# EasyEDA schematic 1-Schematic_servo-power.json
TITLE: Sheet_1; REV: 1.0; Date: 2020-10-06; Sheet: 1/1; Drawn By: udinic; Company: Your Company
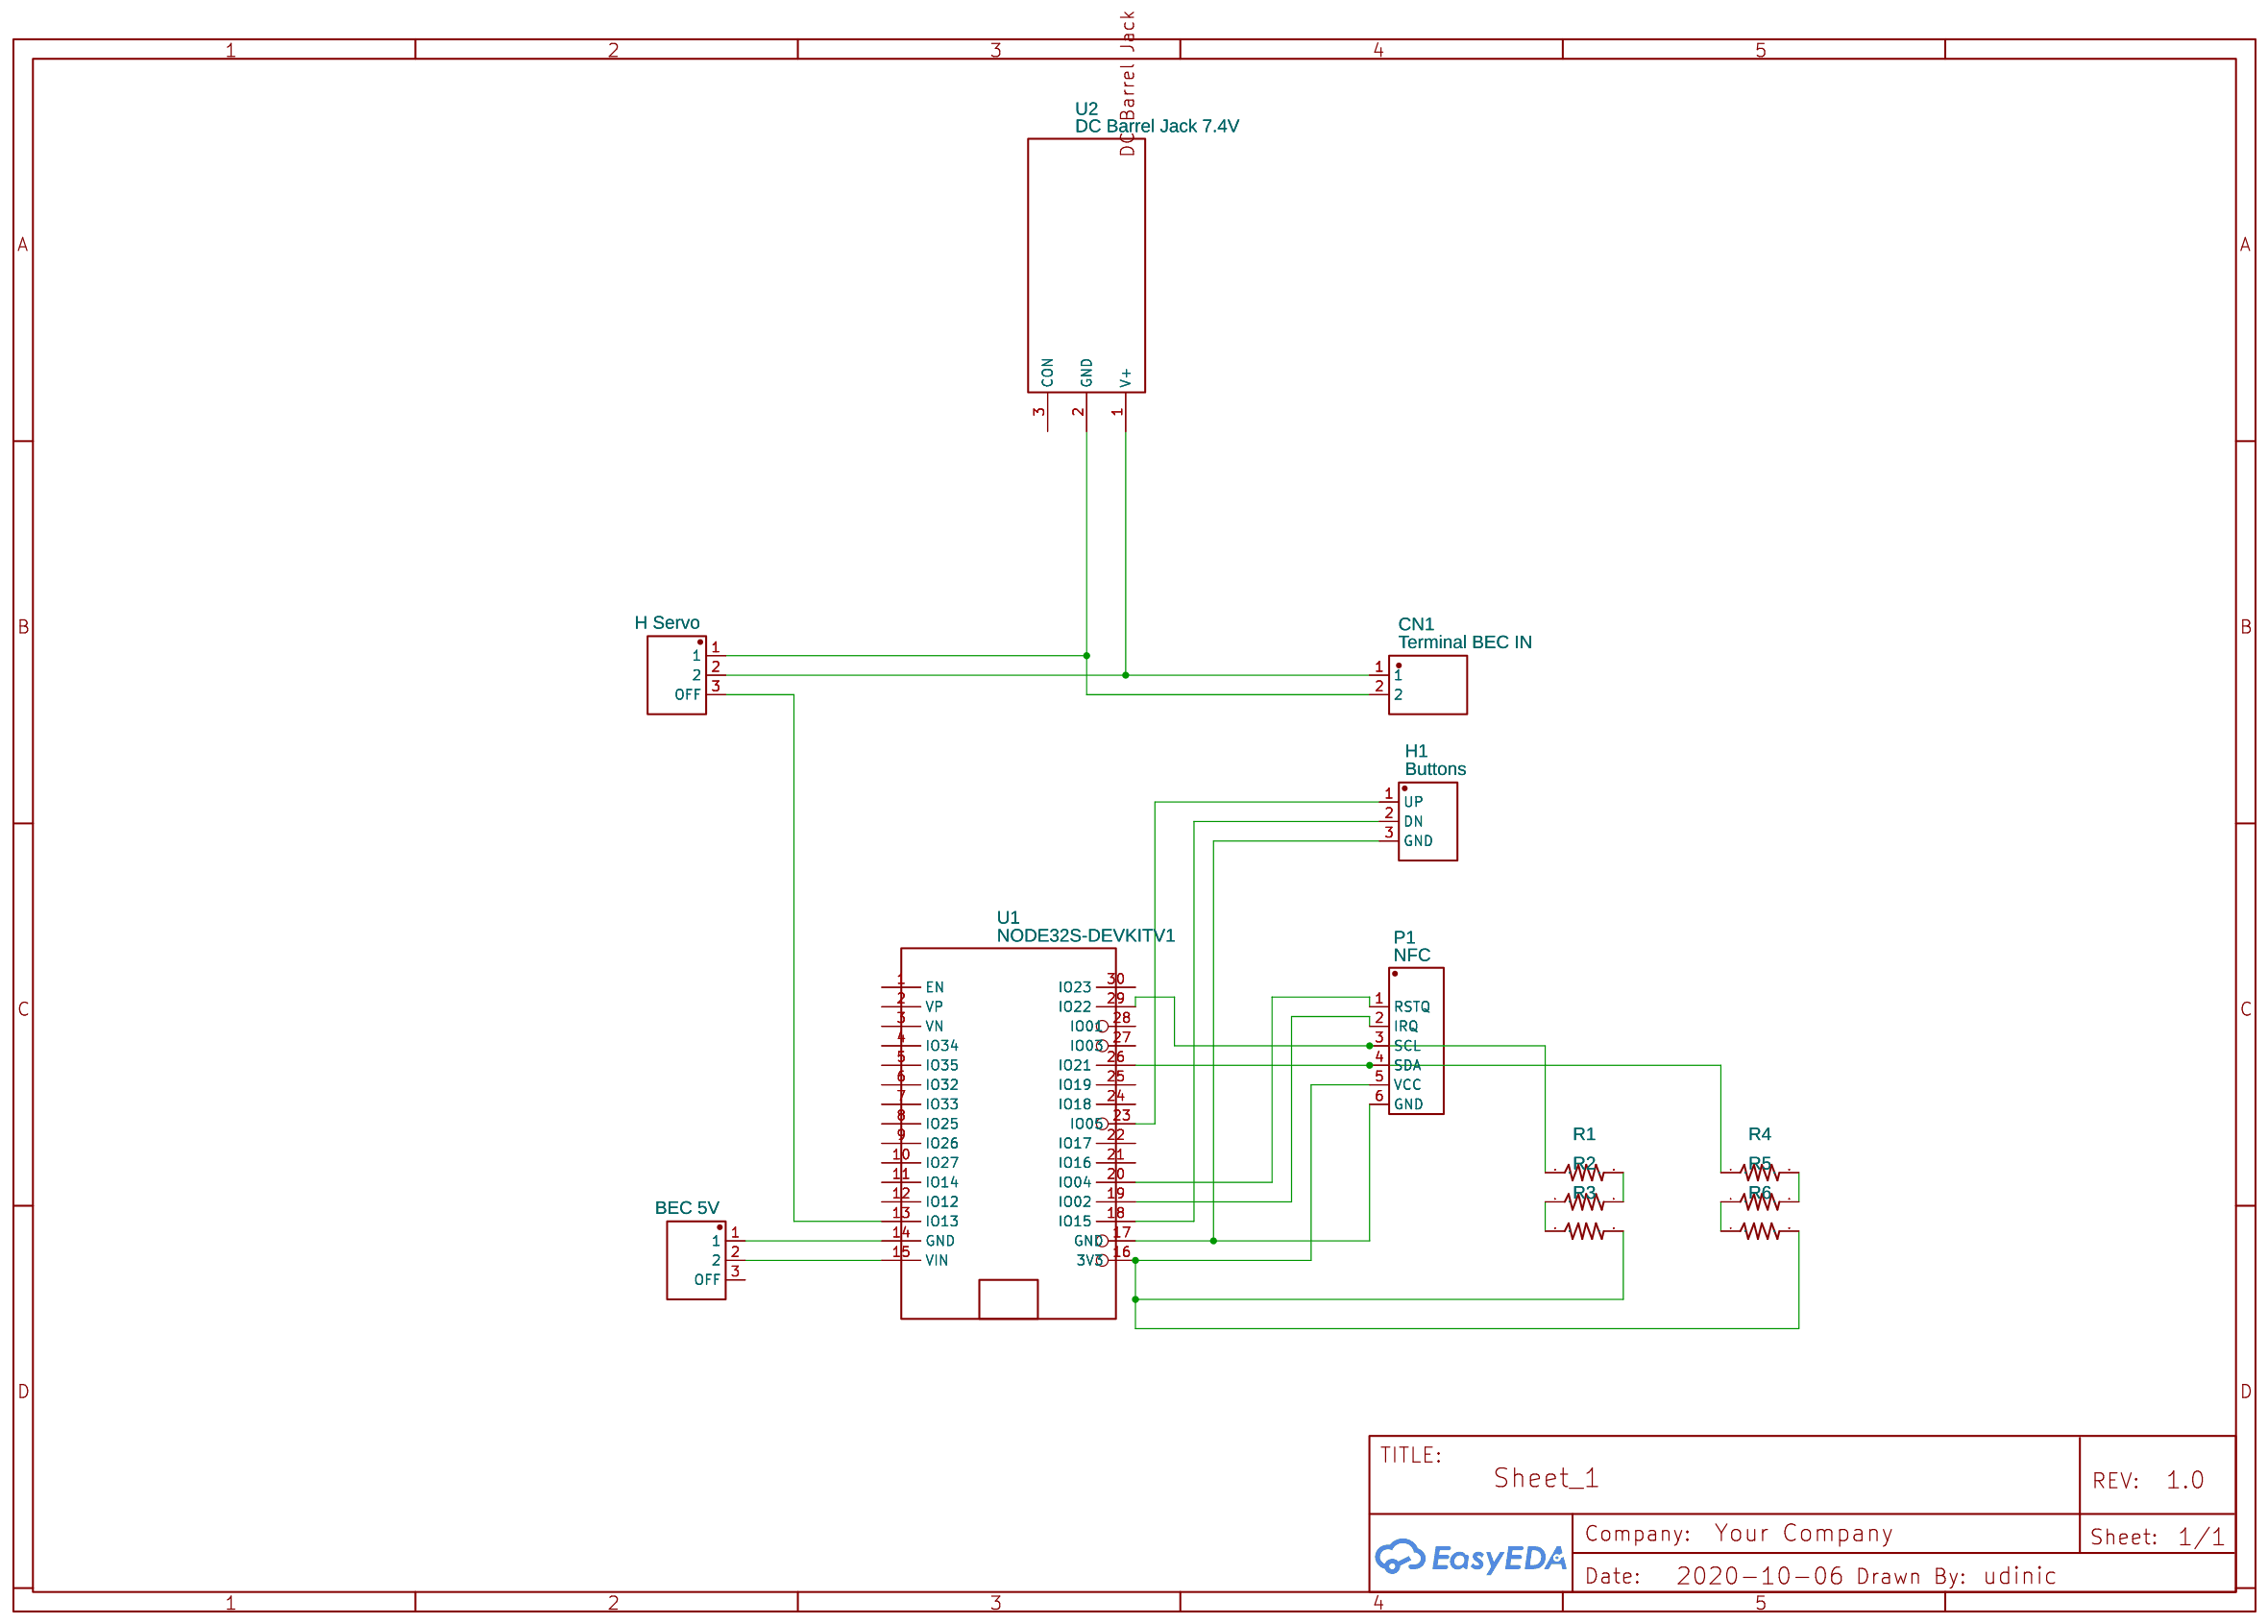
[diagram p0: schematic sheet]

## Parts
CN1  Terminal BEC IN  [XH2.54-2AW]
H1  Buttons  [HDR-TH_3P-P2.54-H-W10.0]
H2  H Servo  [HDR-TH_3P-P2.54-H-W10.0]
H3  BEC 5V  [HDR-TH_3P-P2.54-H-W10.0]
P1  NFC  [HDR-2.54-1X13P]
R1  RESISTOR  [16W-RES]
R2  RESISTOR  [16W-RES]
R3  RESISTOR  [16W-RES]
R4  RESISTOR  [16W-RES]
R5  RESISTOR  [16W-RES]
R6  RESISTOR  [16W-RES]
U1  NODE32S-DEVKITV1  [NODE32S-DEVKITV1]
U2  DC Barrel Jack 7.4V  [DCPOWER JACK 20V4A]

## Library data of the parts
CN1 = Terminal: Supplier: LCSC; Supplier Part: C146113; Manufacturer: Boom Precision Elec; Contributor: LCSC
H1 = HEADERS  PINS2.54 3PINS COPY: Supplier Part: C53043; Supplier: LCSC; Manufacturer: ReliaPro; Manufacturer Part: Headers  Pins2.54; image: http://image.lceda.cn/szlcsc/C53043.jpg
H2 H3 = HEADERS  PINS2.54 3PINS: Supplier Part: C53043; Supplier: LCSC; Manufacturer: ReliaPro; Manufacturer Part: Headers  Pins2.54; image: http://image.lceda.cn/szlcsc/C53043.jpg; Contributor: ABSHpro elec
P1 = Headers_Pins2.54_1x6: Supplier Part: C53043; Supplier: LCSC; Manufacturer: ReliaPro; Manufacturer Part: Headers  Pins2.54; image: http://image.lceda.cn/szlcsc/C53043.jpg; Contributor: kazuhiro_h
R1-R6 = RESISTOR: Contributor: SparkFun
U1 = NODE32S-DEVKITV1: Manufacturer Part: New SchematicLib; Contributor: aid402
U2 = DC Barrel Jack 20V 4A: Contributor: Alex Bornstein; Supplier Part: 10811; Supplier: SparkFun; link: https://www.sparkfun.com/products/10811

## Nets
Net-(CN1-1): CN1.1 H2.2 U2.1(V+)
Net-(CN1-2): CN1.2 H2.1 U2.2(GND)
Net-(H1-1): H1.1(UP) U1.23(IO05)
Net-(H1-2): H1.2(DN) U1.18(IO15)
Net-(H1-3): H1.3(GND) P1.6(GND) U1.17(GND)
Net-(H2-3): H2.3(OFF) U1.13(IO13)
Net-(H3-1): H3.1 U1.14(GND)
Net-(H3-2): H3.2 U1.15(VIN)
Net-(P1-1): P1.1(RSTQ) U1.20(IO04)
Net-(P1-2): P1.2(IRQ) U1.19(IO02)
Net-(P1-3): P1.3(SCL) R1.1 U1.29(IO22)
Net-(P1-4): P1.4(SDA) R4.1 U1.26(IO21)
Net-(P1-5): P1.5(VCC) R3.2 R6.2 U1.16(3V3)
Net-(R1-2): R1.2 R2.2
Net-(R2-1): R2.1 R3.1
Net-(R4-2): R4.2 R5.2
Net-(R5-1): R5.1 R6.1

Not connected (* = marked no-connect by the designer): H3 3(OFF); U1 1(EN) 2(VP) 3(VN) 4(IO34) 5(IO35) 6(IO32) 7(IO33) 8(IO25) 9(IO26) 10(IO27) 11(IO14) 12(IO12) 21(IO16) 22(IO17) 24(IO18) 25(IO19) 27(IO03) 28(IO01) 30(IO23); U2 3(CON)
